# EAGLE design alarmclock4 (EAGLE 7.6.0)
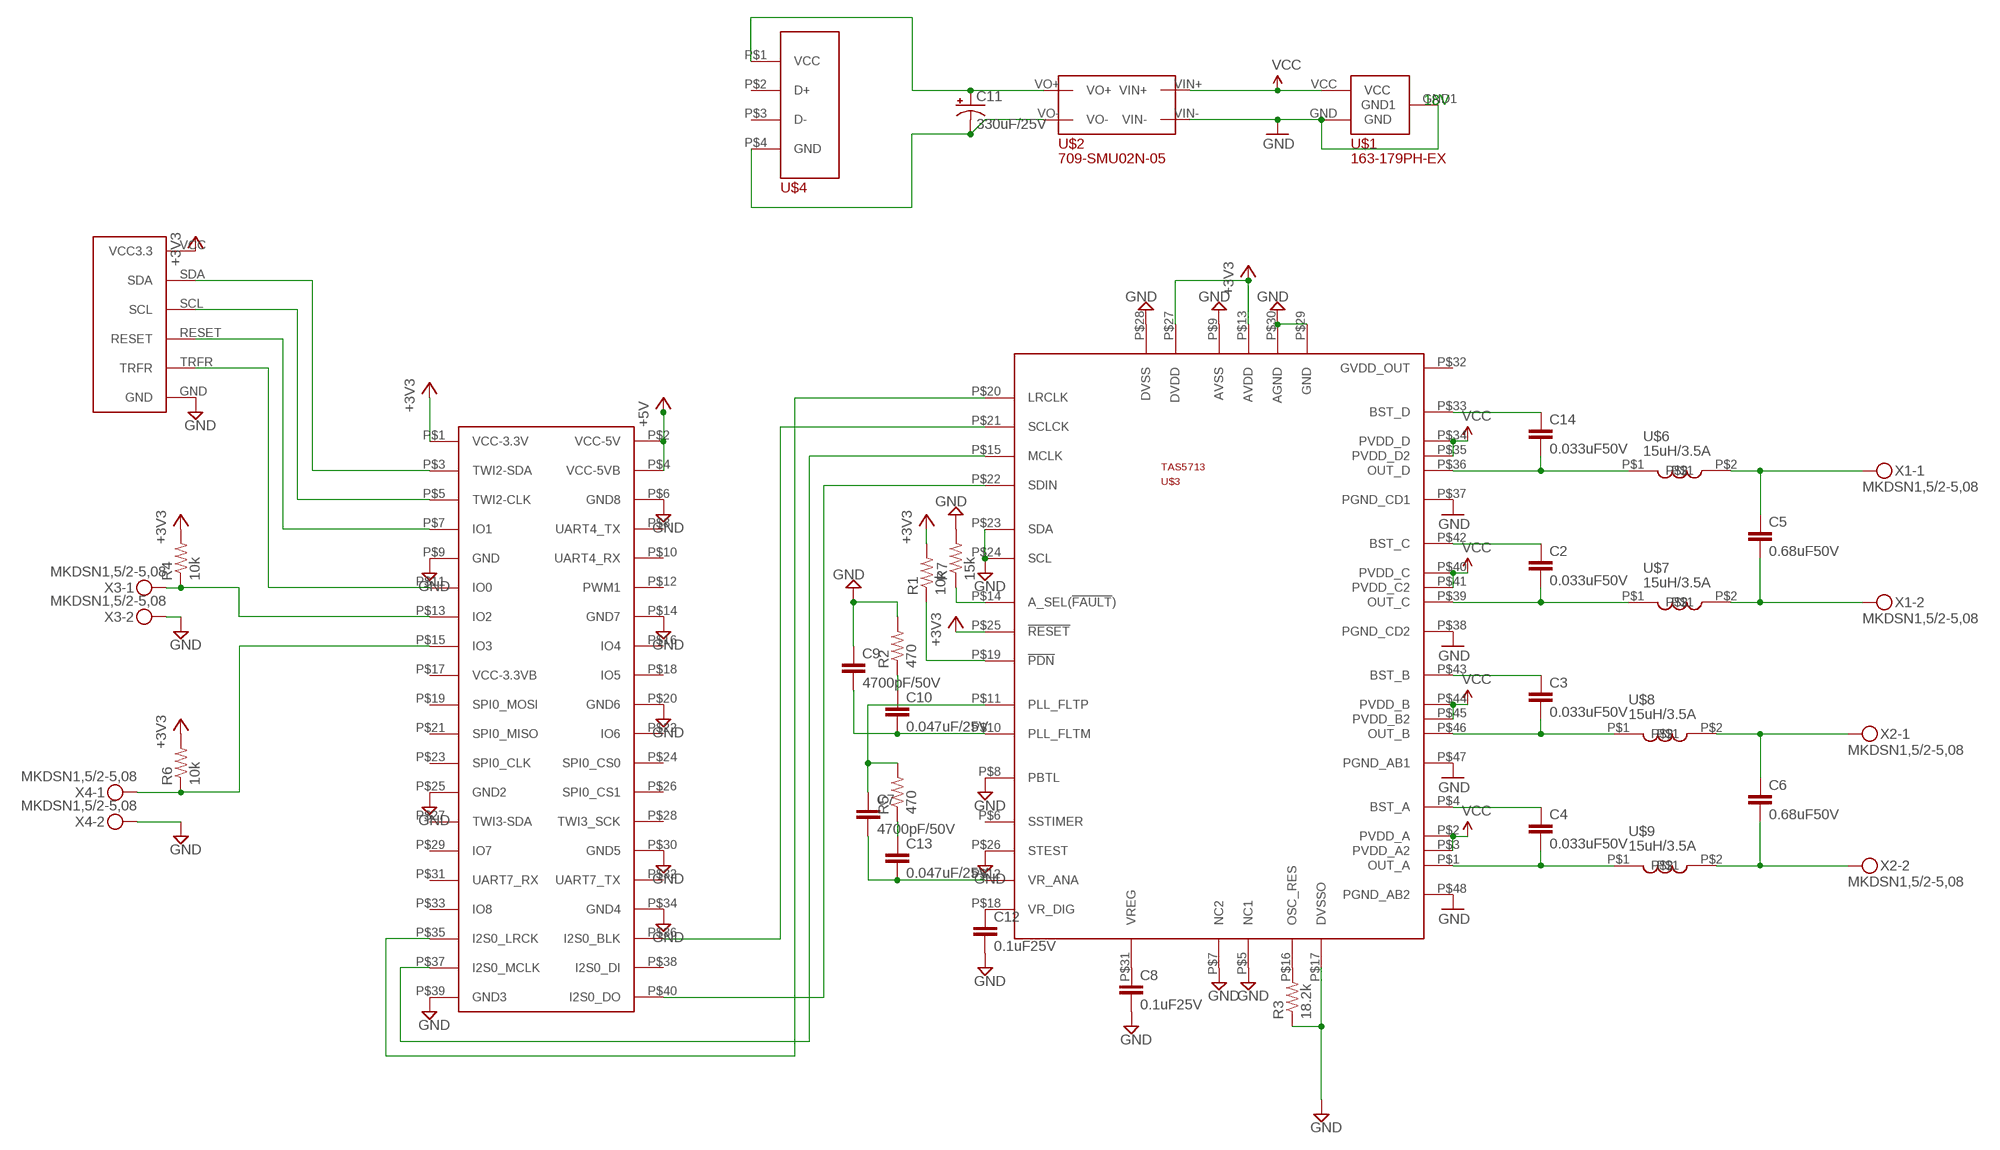
[diagram p0: schematic, sheet 1]

## Parts
C2  0.033uF50V  CAP0603-CAP  [0603-CAP]
C3  0.033uF50V  CAP0603-CAP  [0603-CAP]
C4  0.033uF50V  CAP0603-CAP  [0603-CAP]
C5  0.68uF50V  CAP0603-CAP  [0603-CAP]
C6  0.68uF50V  CAP0603-CAP  [0603-CAP]
C7  4700pF/50V  CAP0603-CAP  [0603-CAP]
C8  0.1uF25V  CAP0603-CAP  [0603-CAP]
C9  4700pF/50V  CAP0603-CAP  [0603-CAP]
C10  0.047uF/25V  CAP0603-CAP  [0603-CAP]
C11  330uF/25V  CAP_POLPTH2  [CPOL-RADIAL-10UF-25V]
C12  0.1uF25V  CAP0603-CAP  [0603-CAP]
C13  0.047uF/25V  CAP0603-CAP  [0603-CAP]
C14  0.033uF50V  CAP0603-CAP  [0603-CAP]
R1  10k  RESISTOR0603-RES  [0603-RES]
R2  470  RESISTOR0603-RES  [0603-RES]
R3  18.2k  RESISTOR0603-RES  [0603-RES]
R4  10k  RESISTOR0603-RES  [0603-RES]
R5  470  RESISTOR0603-RES  [0603-RES]
R6  10k  RESISTOR0603-RES  [0603-RES]
R7  15k  RESISTOR0603-RES  [0603-RES]
U$1  163-179PH-EX  [163-179PH-EX_DIM]
U$2  709-SMU02N-05  [709-SMU02N-05_DIM]
U$3  TAS5713  [TAS5713_DIM]
U$4  USB_TYPEA_CONNECTOR  [USB_DIM]
U$5  BANANAPRO-CON6  [BANANAPRO-CON6_DIM]
U$6  15uH/3.5A  MSS1260INDUCTOR  [MSS1260_DIM]
U$7  15uH/3.5A  MSS1260INDUCTOR  [MSS1260_DIM]
U$8  15uH/3.5A  MSS1260INDUCTOR  [MSS1260_DIM]
U$9  15uH/3.5A  MSS1260INDUCTOR  [MSS1260_DIM]
U$10  SKYWRITER  [SKYWRITER_DIM]
X1  MKDSN1,5/2-5,08  [MKDSN1,5/2-5,08]
X2  MKDSN1,5/2-5,08  [MKDSN1,5/2-5,08]
X3  MKDSN1,5/2-5,08  [MKDSN1,5/2-5,08]
X4  MKDSN1,5/2-5,08  [MKDSN1,5/2-5,08]

## Nets
+3V3: R1.2 R4.2 R6.2 U$3.P$13(AVDD) U$3.P$25(!RESET!) U$3.P$27(DVDD) U$5.P$1(VCC-3.3V) U$10.VCC(VCC3.3)
+5V: U$5.P$2(VCC-5V) U$5.P$4(VCC-5VB)
GND [amplified]: C8.2 C9.1 C12.2 R2.2 R3.1 R7.2 U$1.GND U$1.GND1 U$2.VIN- U$3.P$5(NC1) U$3.P$7(NC2) U$3.P$8(PBTL) U$3.P$9(AVSS) U$3.P$17(DVSSO) U$3.P$23(SDA) U$3.P$24(SCL) U$3.P$26(STEST) U$3.P$28(DVSS) U$3.P$29(GND) U$3.P$30(AGND) U$3.P$37(PGND_CD1) U$3.P$38(PGND_CD2) U$3.P$47(PGND_AB1) U$3.P$48(PGND_AB2) U$5.P$6(GND8) U$5.P$9(GND) U$5.P$14(GND7) U$5.P$20(GND6) U$5.P$25(GND2) U$5.P$30(GND5) U$5.P$34(GND4) U$5.P$39(GND3) U$10.GND X3.2 X4.2
N$1: U$3.P$22(SDIN) U$5.P$40(I2S0_DO)
N$2: U$3.P$15(MCLK) U$5.P$37(I2S0_MCLK)
N$3: C11.1(+) U$2.VO+ U$4.P$1(VCC)
N$4: U$3.P$20(LRCLK) U$5.P$35(I2S0_LRCK)
N$5: U$3.P$21(SCLCK) U$5.P$36(I2S0_BLK)
N$6: R6.1 U$5.P$15(IO3) X4.1
N$7: R3.2 U$3.P$16(OSC_RES)
N$8: R4.1 U$5.P$13(IO2) X3.1
N$9 [amplified]: C6.1 U$8.P$2 X2.1
N$10 [amplified]: C14.2 U$3.P$36(OUT_D) U$6.P$1
N$11: C14.1 U$3.P$33(BST_D)
N$12: C4.1 U$3.P$4(BST_A)
N$13 [amplified]: C4.2 U$3.P$1(OUT_A) U$9.P$1
N$14 [amplified]: C3.2 U$3.P$46(OUT_B) U$8.P$1
N$15: C3.1 U$3.P$43(BST_B)
N$16 [amplified]: C2.2 U$3.P$39(OUT_C) U$7.P$1
N$17: C2.1 U$3.P$42(BST_C)
N$18 [amplified]: C6.2 U$9.P$2 X2.2
N$19 [amplified]: C5.2 U$7.P$2 X1.2
N$20 [amplified]: C5.1 U$6.P$2 X1.1
N$21: C7.1 R5.2 U$3.P$11(PLL_FLTP)
N$22: C7.2 C13.2 U$3.P$12(VR_ANA)
N$23: C9.2 C10.2 U$3.P$10(PLL_FLTM)
N$24: C13.1 R5.1
N$25: C10.1 R2.1
N$26: C8.1 U$3.P$31(VREG)
N$27: C12.1 U$3.P$18(VR_DIG)
N$28: R1.1 U$3.P$19(!PDN!)
N$29 [amplified]: C11.2(-) U$2.VO- U$4.P$4(GND)
N$30: U$5.P$3(TWI2-SDA) U$10.SDA
N$31: U$5.P$5(TWI2-CLK) U$10.SCL
N$32: U$5.P$7(IO1) U$10.RESET
N$33: U$5.P$11(IO0) U$10.TRFR
N$34: R7.1 U$3.P$14(A_SEL(!FAULT!))
VCC [amplified]: U$1.VCC U$2.VIN+ U$3.P$2(PVDD_A) U$3.P$3(PVDD_A2) U$3.P$34(PVDD_D) U$3.P$35(PVDD_D2) U$3.P$40(PVDD_C) U$3.P$41(PVDD_C2) U$3.P$44(PVDD_B) U$3.P$45(PVDD_B2)
Unconnected: U$3.P$6(SSTIMER) U$3.P$32(GVDD_OUT) U$4.P$2(D+) U$4.P$3(D-) U$5.P$8(UART4_TX) U$5.P$10(UART4_RX) U$5.P$12(PWM1) U$5.P$16(IO4) U$5.P$17(VCC-3.3VB) U$5.P$18(IO5) U$5.P$19(SPI0_MOSI) U$5.P$21(SPI0_MISO) U$5.P$22(IO6) U$5.P$23(SPI0_CLK) U$5.P$24(SPI0_CS0) U$5.P$26(SPI0_CS1) U$5.P$27(TWI3-SDA) U$5.P$28(TWI3_SCK) U$5.P$29(IO7) U$5.P$31(UART7_RX) U$5.P$32(UART7_TX) U$5.P$33(IO8) U$5.P$38(I2S0_DI)

## Notes on the sheet
- 18V

## Library data of the parts
C2-C10 C12-C14 = SparkFun-Capacitors:CAP: Capacitor Standard 0603 ceramic capacitor, and 0.1" leaded capacitor.
C11 = SparkFun-Passives:CAP_POL: Capacitor Polarized These are standard SMD and PTH capacitors. Normally 10uF, 47uF, and 100uF in electrolytic and tantalum varieties. Always verify the external diameter of the through hole cap, it varies with capacity, voltage, and manufacturer. The EIA devices should be standard.
R1-R7 = SparkFun-Passives:RESISTOR: Resistor Basic schematic elements and footprints for 0603, 1206, and PTH resistors.
U$1 = mouser:163-179PH-EX: BARREL POWER PLUG
U$2 = mouser:709-SMU02N-05
U$3 = mouser:TAS5713
U$4 = mouser:USB_TYPEA_CONNECTOR: ref Mouser: 710-61400416021
U$5 = mouser:BANANAPRO-CON6: Mouser 571-7-534206-0
U$6-U$9 = mouser:MSS1260
U$10 = skywriter:SKYWRITER
X1-X4 = con-phoenix-508:MKDSN1,5/2-5,08: MKDSN 1,5/ 2-5,08 Printklemme Nennstrom: 13,5 A Nennspannung: 250 V Rastermaß: 5,08 mm Polzahl: 2 Anschlussart: Schraubanschluss Montage: Löten Anschlussrichtung Leiter/Platine: 0 ° Artikelnummer: 1729128 Source: http://eshop.phoenixcontact.com .. 1729128.pdf

## Net classes
1 amplified: width 0.025 mm

## Board
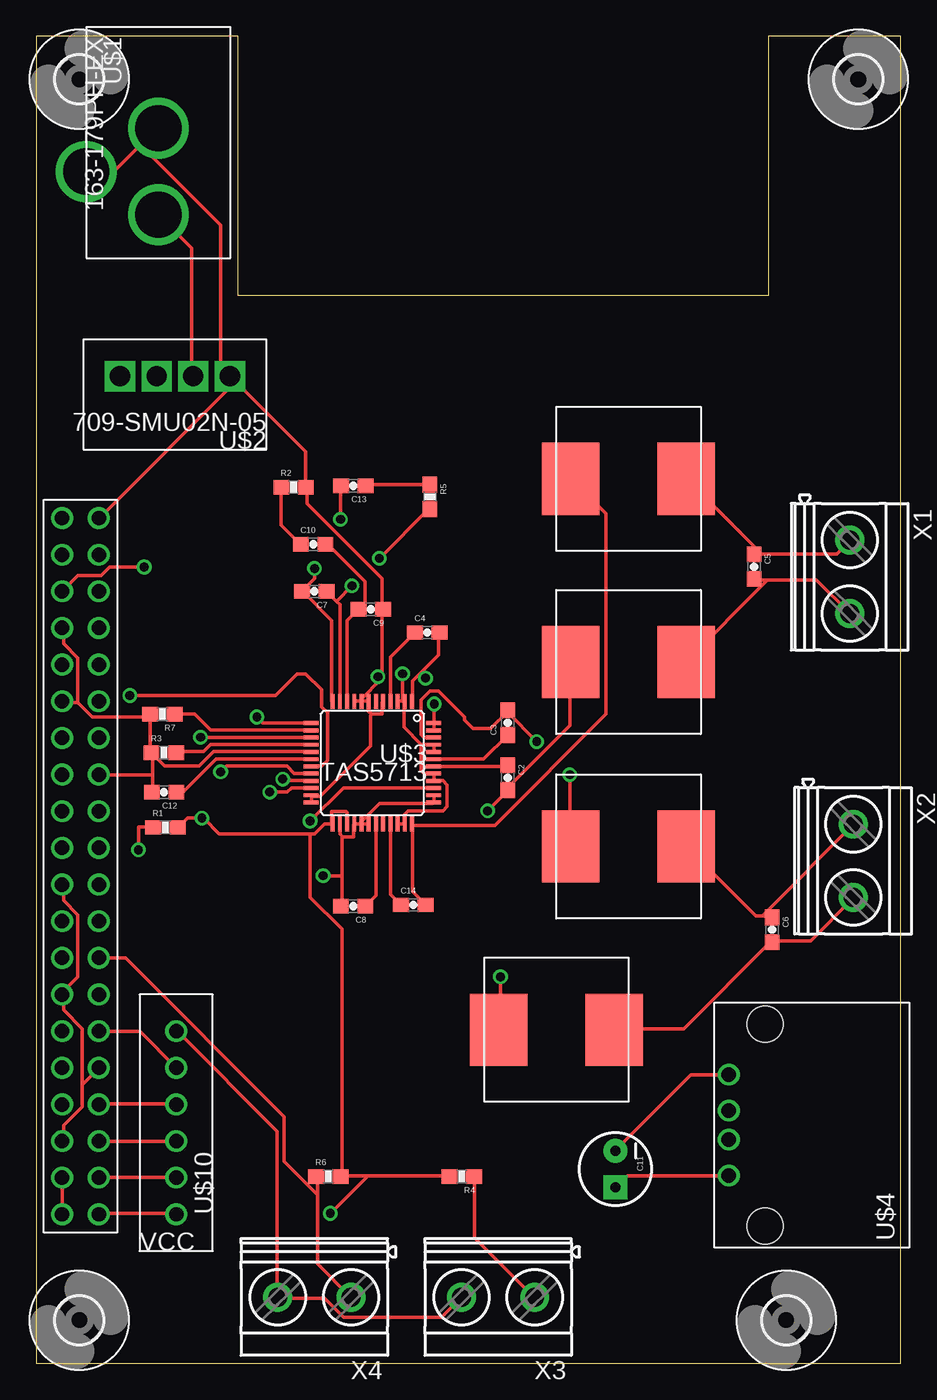
[diagram p1: board, top side]
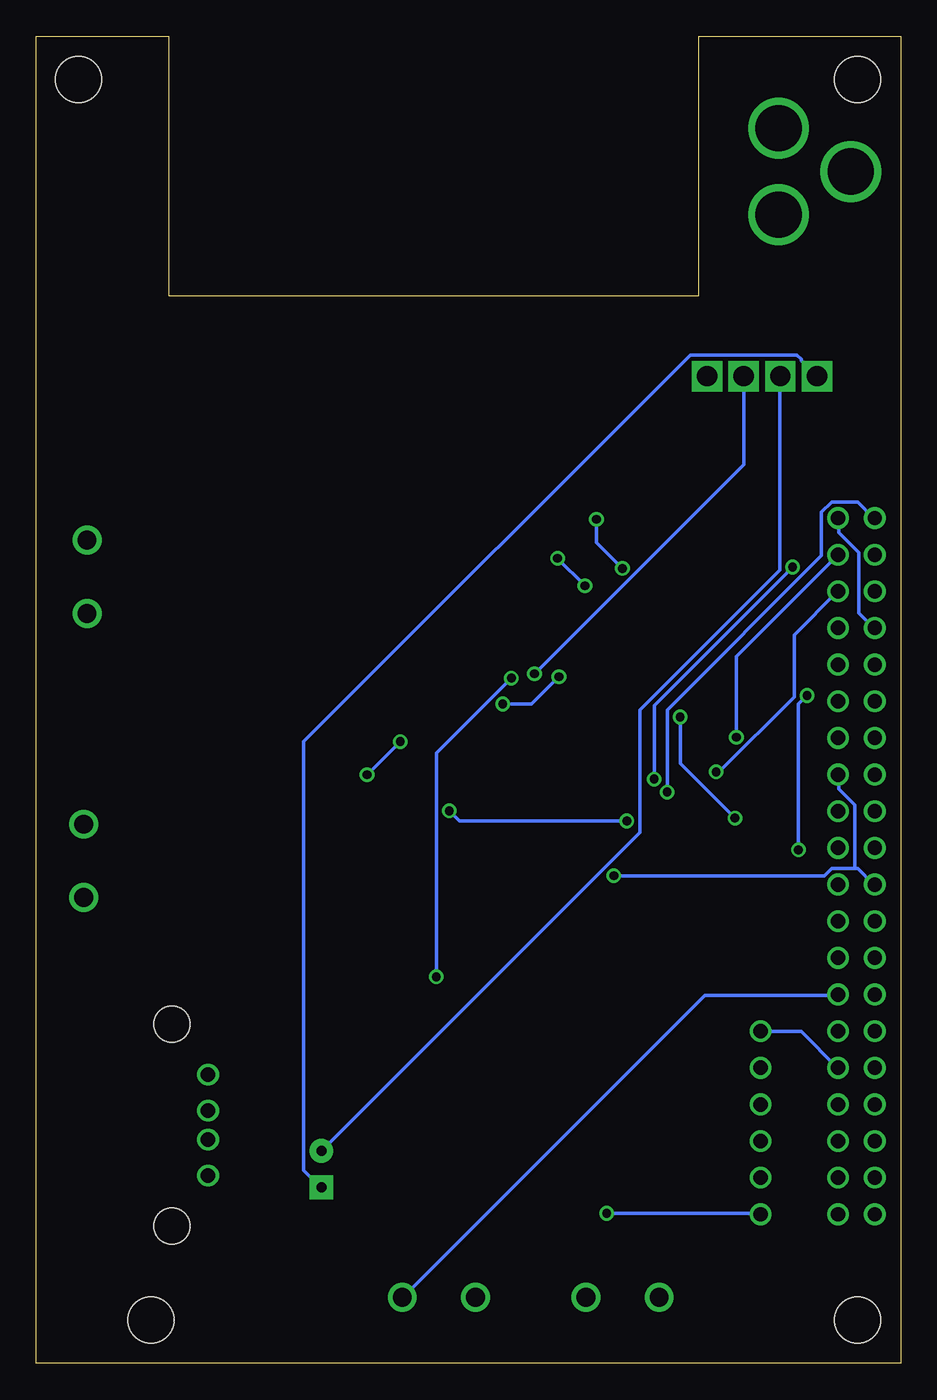
[diagram p2: board, bottom side, seen from below]

Size 59.95 x 92 mm. Coordinates in mm from the lower left corner, seen from the top.
Outline: 0,0 59.95,0 59.95,92 50.75,92 50.75,74 14,74 14,92 0,92 0,0
Copper layers (1*16): Top 0.035mm / dielectric 1.5mm / Bottom 0.035mm
Design rules "default *": minimum track width 10mil, minimum drill 24mil, track to track 8mil, track to pad 8mil, pad to pad 8mil, via to via 8mil, smd to smd 8mil, copper to edge 40mil, drill to drill 8mil, minimum pad ring 10mil, minimum via ring 8mil, stop-mask expansion 4mil, vias tented up to drill 0mil, thermal gap 10mil

### Footprints (pad centres in the part's own frame; a part is rotated, then mirrored left to right if it is on the bottom)
0603-CAP = smd 1.1 x 1: 1 -0.85,0; 2 0.85,0
CPOL-RADIAL-10UF-25V = drill 0.7 pad 1.651 square: 1 1.27,0 | drill 0.7 pad 1.651: 2 -1.27,0
0603-RES = smd 1.1 x 1: 1 -0.85,0; 2 0.85,0
163-179PH-EX_DIM = drill 3.2: GND 0,0; GND1 3,-5; VCC 6,0
709-SMU02N-05_DIM = drill 1.4 square: VIN+ -2.54,-2.54; VIN- -5.08,-2.54; VO+ 2.54,-2.54; VO- 0,-2.54
TAS5713_DIM = smd 0.27 x 1.05: P$1 -2.75,-4.25; P$2 -2.25,-4.25; P$3 -1.75,-4.25; P$4 -1.25,-4.25; P$5 -0.75,-4.25; P$6 -0.25,-4.25; P$7 0.25,-4.25; P$8 0.75,-4.25; P$9 1.25,-4.25; P$10 1.75,-4.25; P$11 2.25,-4.25; P$12 2.75,-4.25; P$25 2.75,4.25; P$26 2.25,4.25; P$27 1.75,4.25; P$28 1.25,4.25; P$29 0.75,4.25; P$30 0.25,4.25; P$31 -0.25,4.25; P$32 -0.75,4.25; P$33 -1.25,4.25; P$34 -1.75,4.25; P$35 -2.25,4.25; P$36 -2.75,4.25 | smd 1.05 x 0.27: P$13 4.25,-2.75; P$14 4.25,-2.25; P$15 4.25,-1.75; P$16 4.25,-1.25; P$17 4.25,-0.75; P$18 4.25,-0.25; P$19 4.25,0.25; P$20 4.25,0.75; P$21 4.25,1.25; P$22 4.25,1.75; P$23 4.25,2.25; P$24 4.25,2.75; P$37 -4.25,2.75; P$38 -4.25,2.25; P$39 -4.25,1.75; P$40 -4.25,1.25; P$41 -4.25,0.75; P$42 -4.25,0.25; P$43 -4.25,-0.25; P$44 -4.25,-0.75; P$45 -4.25,-1.25; P$46 -4.25,-1.75; P$47 -4.25,-2.25; P$48 -4.25,-2.75
USB_DIM = drill 1: P$1 -3,0; P$2 -0.5,0; P$3 1.5,0; P$4 4,0 | hole 2.5: -6.5,-2.5; 7.5,-2.5
BANANAPRO-CON6_DIM = drill 1: P$1 -1.27,10.16; P$2 1.27,10.16; P$3 -1.27,7.62; P$4 1.27,7.62; P$5 -1.27,5.08; P$6 1.27,5.08; P$7 -1.27,2.54; P$8 1.27,2.54; P$9 -1.27,0; P$10 1.27,0; P$11 -1.27,-2.54; P$12 1.27,-2.54; P$13 -1.27,-5.08; P$14 1.27,-5.08; P$15 -1.27,-7.62; P$16 1.27,-7.62; P$17 -1.27,-10.16; P$18 1.27,-10.16; P$19 -1.27,-12.7; P$20 1.27,-12.7; P$21 -1.27,-15.24; P$22 1.27,-15.24; P$23 -1.27,-17.78; P$24 1.27,-17.78; P$25 -1.27,-20.32; P$26 1.27,-20.32; P$27 -1.27,-22.86; P$28 1.27,-22.86; P$29 -1.27,-25.4; P$30 1.27,-25.4; P$31 -1.27,-27.94; P$32 1.27,-27.94; P$33 -1.27,-30.48; P$34 1.27,-30.48; P$35 -1.27,-33.02; P$36 1.27,-33.02; P$37 -1.27,-35.56; P$38 1.27,-35.56; P$39 -1.27,-38.1; P$40 1.27,-38.1
MSS1260_DIM = smd 5 x 4: P$1 0,4; P$2 0,-4
SKYWRITER_DIM = drill 1: GND 0,7.62; RESET 0,2.54; SCL 0,0; SDA 0,-2.54; TRFR 0,5.08; VCC 0,-5.08
3,2 = hole 3.2: 0,0
MKDSN1,5/2-5,08 = drill 1.3 pad 2: 1 -2.561,0.025; 2 2.519,0.025

### Placement (x,y rotation side)
C2  32.7,40.61 270 top
C3  32.7,44.42 90 top
C4  27.12,50.66 0 top
C5  49.77,55.23 270 top
C6  51.02,30.05 270 top
C7  19.29,53.51 180 top
C8  21.98,31.69 180 top
C9  23.2,52.27 180 top
C10  19.21,56.77 0 top
C11  40.17,13.47 270 top
C12  8.88,39.6 180 top
C13  22,60.84 180 top
C14  26.15,31.78 0 top
R1  8.97,37.15 0 top
R2  17.85,60.73 0 top
R3  8.85,42.33 0 top
R4  29.51,12.95 180 top
R5  27.3,60.08 270 top
R6  20.26,12.95 0 top
R7  8.75,45 180 top
U$1  8.48,85.61 270 top
U$2  8.36,65.88 180 top
U$3  23.31,41.63 180 top
U$4  48.02,16.02 90 top
U$5  3.08,20.49 180 top
U$6  41.07,61.31 90 top
U$7  41.07,48.61 90 top
U$8  41.07,35.83 90 top
U$9  36.07,23.13 90 top
U$10  9.72,15.41 0 top
U$11  [3,2]  3,3 0 top
U$12  [3,2]  57,89 0 top
U$13  [3,2]  52,3 0 top
U$15  [3,2]  3,89 0 top
X1  56.39,54.5 270 top
X2  56.63,34.81 270 top
X3  32.01,4.6 180 top
X4  19.27,4.6 180 top

### Tracks (layer width: path | path; a pad name or v marks a point on that pad's centre or on a via)
+3V3  (via drill 0.61)
  Top 0.254: U$3.P$27 21.56,38.19 21.5,38.25 20.5,38.25 20.5,37.44 | 20.5,37.44 U$3.P$25 | U$5.P$1 4.4,10.4 9.7,10.4 U$10.VCC | 22.9,13 28.6,13 R4.2 | 22.9,13 21.2,13 R6.2 21.2,13.1 21.2,30.1 19,32.3 19,36.7 | v15.3,44.8 15.7,44.4 19,44.4 U$3.P$13 | R1.2 9.9,37.2 10.5,37.8 v11.5,37.8 11.6,37.8 12.7,36.7 19,36.7 | 19,36.7 19.3,36.7 20,37.4 20.4,37.4 20.5,37.44 | v20.4,10.4 22.9,12.9 22.9,13
  Bottom 0.254: v15.3,44.8 15.3,41.6 v11.5,37.8 | v20.4,10.4 9.8,10.4 U$10.VCC
+5V
  Top 0.254: U$5.P$2 1.8,10.4 1.8,12.8 U$5.P$4
GND  (via drill 0.61)
  Top 0.254: 23.25,45 23.06,45.19 U$3.P$7 23,45.9 22.6,45.9 U$3.P$8 | 23.25,45 24,45 24,45.82 U$3.P$5 | U$3.P$26 21.06,36.69 21.25,36.5 | 21.25,36.5 22,36.5 22,37.32 U$3.P$28 22.1,37.4 22.5,37.4 U$3.P$29 | U$1.GND1 3.5,82.7 5.5,82.7 8.4,85.6 U$1.GND 7.3,84.4 12.8,78.9 12.8,69.1 13.4,68.5 U$2.VIN- | U$2.VIN- 13.5,68.4 18.7,63.2 R2.2 18.8,60.7 18.8,59.6 24,54.4 24,52.3 C9.1 24,52.2 24,47.6 | U$3.P$24 19.1,38.9 19.1,39.3 U$3.P$23 19.2,39.3 19.7,39.3 23.2,42.8 23.2,44.9 23.25,45 | U$3.P$47 27.6,43.9 27.6,44.3 U$3.P$48 27.6,44.5 v27.6,45.7 | U$3.P$9 22.1,45.9 22.5,45.9 U$3.P$8 | 24,47.6 24,47.5 22.5,46 U$3.P$8 | 24,47.6 v23.7,47.6 | U$3.P$17 19,42.4 12.3,42.4 11.3,41.4 8.9,41.4 8,42.3 R3.1 | R3.1 7.9,42.4 R7.2 7.8,44.8 3.9,44.8 2.9,45.8 | 8.1,40.8 8.1,42.1 R3.1 | 8.1,40.8 8.1,39.6 C12.2 | 8.1,40.8 4.4,40.8 U$5.P$25 | 2.9,45.8 1.9,45.8 U$5.P$30 | 2.9,45.8 2.9,48.9 1.9,49.9 1.9,50.9 U$5.P$34 | X3.2 29.4,4.5 28.1,3.2 21.3,3.2 20,4.5 16.8,4.5 X4.2 16.7,4.6 16.7,16.1 9.8,23 U$10.GND | U$3.P$38 27.6,39.3 27.6,38.9 U$3.P$37 27.5,38.8 23.8,38.8 22.5,37.5 U$3.P$29 | U$3.P$29 22.6,37.4 23,37.4 U$3.P$30 | 21.2,33.8 21.2,36.4 21.25,36.5 | 21.2,33.8 21.2,31.7 C8.2 | 3.2,19.3 3.2,17.8 1.9,16.5 1.9,15.5 U$5.P$6 | 3.2,19.3 4.3,20.4 U$5.P$9 | 3.2,19.3 3.2,23.2 1.9,24.5 1.9,25.5 U$5.P$14 1.8,25.7 2.9,26.8 2.9,31.1 1.9,32.1 1.9,33.1 U$5.P$20 | v19.9,33.8 21.2,33.8 | U$2.VIN- 13.8,68 4.4,58.6 U$5.P$39
  Bottom 0.254: v27.6,45.7 25.6,45.7 v23.7,47.6 | U$5.P$39 4.3,58.5 4.3,57.6 2.9,56.2 2.9,52 1.9,51 U$5.P$34 | U$10.GND 9.7,23 6.9,23 4.4,20.5 U$5.P$9 | v19.9,33.8 5.3,33.8 4.8,34.3 3.2,34.3 | 3.2,34.3 3,34.3 1.9,33.2 U$5.P$20 | 3.2,34.3 3.2,38.7 4.3,39.8 4.3,40.8 U$5.P$25
N$1  (via drill 0.61)
  Top 0.254: v16.2,39.6 17.4,39.6 17.7,39.9 19,39.9 U$3.P$22
  Bottom 0.254: v16.2,39.6 16.2,45.3 5.5,56 5.5,59 4.8,59.7 3,59.7 1.9,58.6 U$5.P$40
N$2  (via drill 0.61)
  Top 0.254: v11.4,43.4 19,43.4 U$3.P$15
  Bottom 0.254: v11.4,43.4 11.4,49 4.4,56 U$5.P$37
N$3
  Top 0.254: U$4.P$1 48,13 41,13 40.2,12.2 C11.1
  Bottom 0.254: U$2.VO+ 5.9,68.5 6.9,69.5 6.9,69.6 7.2,69.9 14.6,69.9 41.4,43.1 41.4,13.4 40.2,12.2 C11.1
N$4  (via drill 0.61)
  Top 0.254: v12.8,41 13.2,41.4 17.4,41.4 17.9,40.9 19,40.9 U$3.P$20
  Bottom 0.254: v12.8,41 12.6,41 7.4,46.2 7.4,50.5 4.4,53.5 U$5.P$35
N$5  (via drill 0.61)
  Top 0.254: v17.1,40.5 17.2,40.4 19,40.4 U$3.P$21 | v7.5,55.2 5.1,55.2 4.5,54.6 2.9,54.6 1.9,53.6 U$5.P$36
  Bottom 0.254: v17.1,40.5 17.1,45.6 v7.5,55.2
N$6
  Top 0.254: 19.5,11.8 19.5,6.9 21.8,4.6 X4.1 | 19.5,11.8 19.5,12.9 R6.1 | U$5.P$15 4.4,28.1 6.2,28.1 17.2,17.1 17.2,14 19.4,11.8 19.5,11.8
N$7
  Top 0.254: U$3.P$16 19,42.9 12.1,42.9 11.6,42.4 9.7,42.4 R3.2
N$8
  Top 0.254: R4.1 30.4,12.9 30.4,8.7 34.5,4.6 X3.1
  Bottom 0.254: U$5.P$13 4.4,25.5 13.6,25.5 34.5,4.6 X3.1
N$9
  Top 0.254: 50.4,31 49.9,31 U$8.P$2 | 50.4,31 51,31 C6.1 | X2.1 56.6,37.3 50.4,31.1 50.4,31
N$10
  Top 0.254: 26.1,37.3 26.1,32.7 27,31.8 C14.2 | 26.1,37.3 U$3.P$36 | 26.1,37.3 31.8,37.3 39.5,45 39.5,58.9 37.1,61.3 U$6.P$1
N$11
  Top 0.254: U$3.P$33 24.56,32.52 C14.1
N$12
  Top 0.254: U$3.P$4 24.56,48.95 C4.1
N$13  (via drill 0.61)
  Top 0.254: 26.65,47.85 27.9,49.1 27.9,50.6 C4.2 | 26.65,47.85 26.1,47.3 26.1,45.9 U$3.P$1 | v27,47.5 26.65,47.85 | v32.2,26.8 32.2,23.3 32.1,23.2 U$9.P$1
  Bottom 0.254: v27,47.5 32.2,42.3 v32.2,26.8
N$14  (via drill 0.61)
  Top 0.254: U$3.P$46 27.5,43.4 26.9,43.4 26.7,43.6 26.7,46 27.3,46.6 27.9,46.6 29.7,44.8 29.7,44.6 30.3,44 31.5,44 32.7,45.2 C3.2 32.7,45.1 v34.7,43.1 | v37,40.8 37,35.9 U$8.P$1
  Bottom 0.254: v37,40.8 v34.7,43.1
N$15
  Top 0.254: U$3.P$43 31.01,41.88 C3.1
N$16  (via drill 0.61)
  Top 0.254: v19,37.6 21.3,39.9 27.5,39.9 U$3.P$39 | v31.3,38.3 32.7,39.7 C2.2 32.6,39.8 37,44.2 37,48.6 U$7.P$1
  Bottom 0.254: v19,37.6 30.6,37.6 v31.3,38.3
N$17
  Top 0.254: U$3.P$42 32.62,41.38 C2.1
N$18
  Top 0.254: X2.2 56.6,32.2 53.7,29.3 51.1,29.3 C6.2 50.9,29.2 44.9,23.2 40.1,23.2 U$9.P$2
N$19
  Top 0.254: 50.6,54.3 54.1,54.3 56.4,52 X1.2 | 50.6,54.3 49.8,54.3 C5.2 | U$7.P$2 45.1,48.7 50.6,54.2 50.6,54.3
N$20
  Top 0.254: X1.1 56.4,57 55.5,56.1 49.8,56.1 C5.1 50.2,56.2 45.1,61.3 U$6.P$2
N$21  (via drill 0.61)
  Top 0.254: U$3.P$11 21.06,52.59 20.82,52.82 | 20.82,52.82 C7.1 | v23.8,55.8 27.2,59.2 R5.2 | 20.82,52.82 v21.9,53.9
  Bottom 0.254: v21.9,53.9 v23.8,55.8
N$22  (via drill 0.61)
  Top 0.254: U$3.P$12 20.5,45.9 20.5,51.5 18.5,53.5 C7.2 18.5,53.6 19.3,54.4 v19.3,55.1 | v21.1,58.5 21.1,60.8 C13.2
  Bottom 0.254: v21.1,58.5 21.1,56.9 v19.3,55.1
N$23
  Top 0.254: U$3.P$10 21.56,51.48 C9.2 22.4,52.3 22.8,52.7 22.8,54.2 20.3,56.7 20.1,56.7 C10.2
N$24
  Top 0.254: C13.1 22.9,60.9 27.2,60.9 R5.1
N$25
  Top 0.254: R2.1 17,58.1 18.3,56.8 C10.1
N$26
  Top 0.254: U$3.P$31 23.56,32.42 C8.1
N$27
  Top 0.254: C12.1 10.2,39.6 12.5,41.9 19,41.9 U$3.P$18
N$28  (via drill 0.61)
  Top 0.254: v7.1,35.6 7.1,37.2 8.1,37.2 R1.1 | v6.5,46.3 16.6,46.3 18.1,47.8 18.7,47.8 19.8,46.7 19.8,45.5 20.2,45.1 20.2,41.8 19.8,41.4 19.1,41.4 U$3.P$19
  Bottom 0.254: v7.1,35.6 7.1,45.7 v6.5,46.3
N$29
  Top 0.254: U$4.P$4 48,20 45.4,20 40.2,14.8 C11.2
  Bottom 0.254: U$2.VO- 8.4,68.4 8.4,55 18.1,45.3 18.1,36.8 40.1,14.8 C11.2
N$30
  Top 0.254: U$5.P$3 4.4,12.9 9.7,12.9 U$10.SDA
N$31
  Top 0.254: U$5.P$5 4.4,15.4 9.7,15.4 U$10.SCL
N$32
  Top 0.254: U$5.P$7 4.4,18 9.7,18 U$10.RESET
N$33
  Top 0.254: U$5.P$11 4.4,23 7.2,23 9.7,20.5 U$10.TRFR
N$34
  Top 0.254: R7.1 11,45 12.1,43.9 19,43.9 U$3.P$14
VCC  (via drill 0.61)
  Top 0.254: U$3.P$44 27.6,42.4 27.6,42.8 U$3.P$45 27.5,42.9 26.7,42.9 | 25.4,45.9 25.5,45.9 U$3.P$2 25.5,45.8 25.5,44.1 26.7,42.9 | 25.4,45.9 25.1,45.9 U$3.P$3 | U$3.P$34 25.1,37.4 25.5,37.4 U$3.P$35 25.5,37.5 25.5,38 25.8,38.3 28.2,38.3 28.5,38.6 28.5,40.1 28.2,40.4 27.7,40.4 U$3.P$40 27.6,40.4 27.6,40.8 U$3.P$41 27.5,40.9 26.9,40.9 26.7,41.1 26.7,42.9 | U$2.VIN+ 10.8,68.5 10.8,77.3 8.5,79.6 U$1.VCC | v25.4,47.8 25.4,45.9
  Bottom 0.254: v25.4,47.8 10.9,62.3 10.9,68.4 U$2.VIN+